# Altium schematic sheet COMS0004 SwC_Main.SchDoc: BLUEsat Switching Circuit Overview
size A3; Engineer: D. JEDRYCHOWSKI; Organization: BLUEsat Project; Address1: Room 419; Address2: School of EE&T; Address3: UNSW, NSW 2052; Address4: Australia; DocumentNumber: COMS0004; SheetNumber: 1; SheetTotal: 4; Description: Overview of Switching Circuit; Version: 1.0
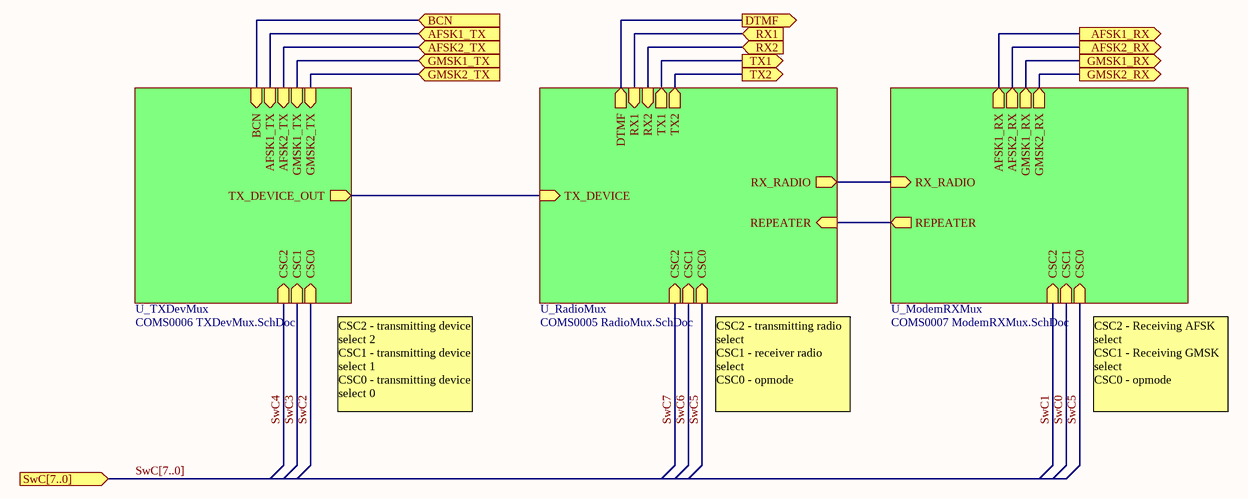
[diagram p0: COMS0004 SwC_Main.SchDoc]

## Sub-sheets
U_ModemRXMux = COMS0007 ModemRXMux.SchDoc: RX_RADIO (in), REPEATER (out), AFSK1_RX (out), AFSK2_RX (out), GMSK1_RX (out), GMSK2_RX (out), CSC2 (in), CSC1 (in), CSC0 (in)
U_RadioMux = COMS0005 RadioMux.SchDoc: RX_RADIO (out), RX1 (in), RX2 (in), TX1 (out), TX2 (out), TX_DEVICE (in), REPEATER (in), CSC2 (in), CSC1 (in), CSC0 (in), DTMF (out)
U_TXDevMux = COMS0006 TXDevMux.SchDoc: CSC2 (in), BCN (in), AFSK1_TX (in), AFSK2_TX (in), GMSK1_TX (in), GMSK2_TX (in), TX_DEVICE_OUT (out), CSC1 (in), CSC0 (in)

## Ports
AFSK1_RX (out), AFSK1_TX (in), AFSK2_RX (out), AFSK2_TX (in), BCN (in), DTMF (out), GMSK1_RX (out), GMSK1_TX (in), GMSK2_RX (out), GMSK2_TX (in), RX1 (in), RX2 (in), SwC[7..0] (in), TX1 (out), TX2 (out)

## Nets
AFSK1_RX: port AFSK1_RX, sheet U_ModemRXMux/AFSK1_RX
AFSK1_TX: port AFSK1_TX, sheet U_TXDevMux/AFSK1_TX
AFSK2_RX: port AFSK2_RX, sheet U_ModemRXMux/AFSK2_RX
AFSK2_TX: port AFSK2_TX, sheet U_TXDevMux/AFSK2_TX
BCN: port BCN, sheet U_TXDevMux/BCN
DTMF: port DTMF, sheet U_RadioMux/DTMF
GMSK1_RX: port GMSK1_RX, sheet U_ModemRXMux/GMSK1_RX
GMSK1_TX: port GMSK1_TX, sheet U_TXDevMux/GMSK1_TX
GMSK2_RX: port GMSK2_RX, sheet U_ModemRXMux/GMSK2_RX
GMSK2_TX: port GMSK2_TX, sheet U_TXDevMux/GMSK2_TX
RX1: port RX1, sheet U_RadioMux/RX1
RX2: port RX2, sheet U_RadioMux/RX2
SwC0: sheet U_ModemRXMux/CSC1
SwC1: sheet U_ModemRXMux/CSC2
SwC2: sheet U_TXDevMux/CSC0
SwC3: sheet U_TXDevMux/CSC1
SwC4: sheet U_TXDevMux/CSC2
SwC5: sheet U_ModemRXMux/CSC0, sheet U_RadioMux/CSC0
SwC6: sheet U_RadioMux/CSC1
SwC7: sheet U_RadioMux/CSC2
TX1: port TX1, sheet U_RadioMux/TX1
TX2: port TX2, sheet U_RadioMux/TX2
(unnamed): sheet U_ModemRXMux/RX_RADIO, sheet U_RadioMux/RX_RADIO
(unnamed): sheet U_ModemRXMux/REPEATER, sheet U_RadioMux/REPEATER
(unnamed): sheet U_TXDevMux/TX_DEVICE_OUT, sheet U_RadioMux/TX_DEVICE

## Buses and harness runs
bus SwC[7..0] = port SwC[7..0]

## Notes on the sheet
- CSC2 - transmitting device select 2
  CSC1 - transmitting device select 1
  CSC0 - transmitting device select 0
- CSC2 - transmitting radio select
  CSC1 - receiver radio select
  CSC0 - opmode
- CSC2 - Receiving AFSK select
  CSC1 - Receiving GMSK select
  CSC0 - opmode
- Title
- Description:
- Size:
- Author:
- Date:
- A3
- Time:
- Version
- Sheet:
- Drawing No.:
- of
- File: